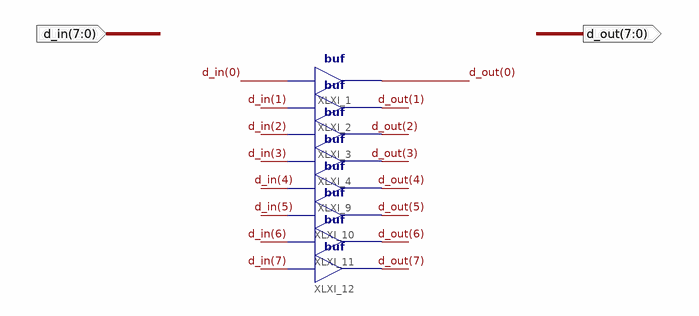
[diagram p0: schematic sheet 1]
// Xilinx ISE schematic buf8.sch (spartan6) as structural Verilog: 8 symbols, 2 ports
module buf8 (
  input  [7:0] d_in,
  output [7:0] d_out
);

  buf XLXI_1 (d_out[0], d_in[0]);
  buf XLXI_2 (d_out[1], d_in[1]);
  buf XLXI_3 (d_out[2], d_in[2]);
  buf XLXI_4 (d_out[3], d_in[3]);
  buf XLXI_9 (d_out[4], d_in[4]);
  buf XLXI_10 (d_out[5], d_in[5]);
  buf XLXI_11 (d_out[6], d_in[6]);
  buf XLXI_12 (d_out[7], d_in[7]);
endmodule
